# Altium schematic sheet 0_AD_ST32-Overview.SchDoc
size Letter; SheetNumber: 1; SheetTotal: 4
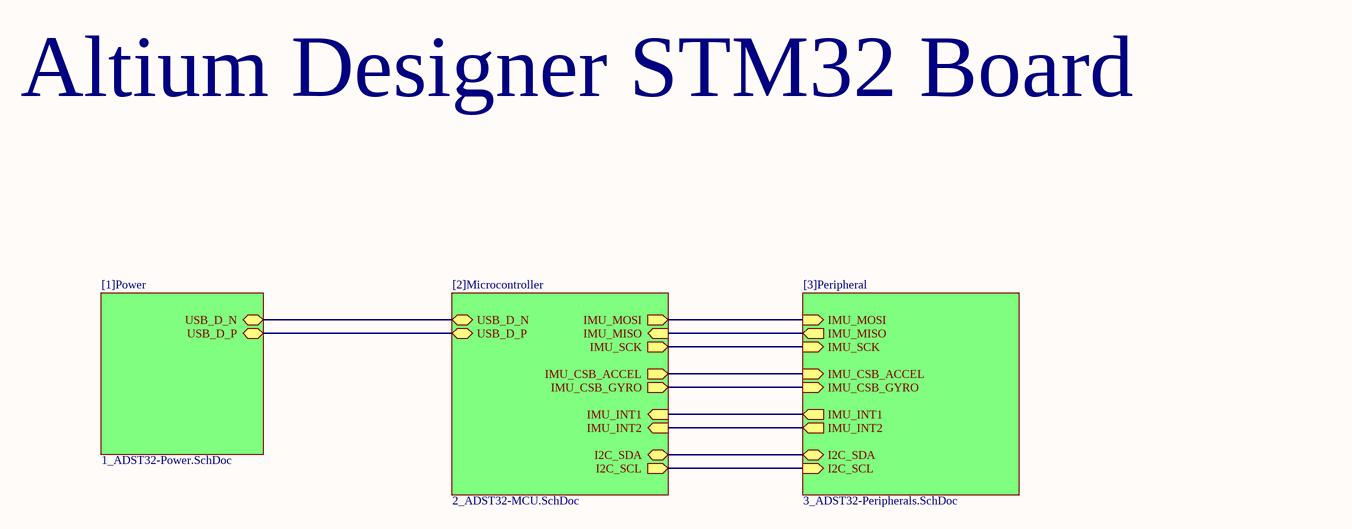
[diagram p0: 0_AD_ST32-Overview.SchDoc]

## Sub-sheets
[1]Power = 1_ADST32-Power.SchDoc: USB_D_N (bidir), USB_D_P (bidir)
[2]Microcontroller = 2_ADST32-MCU.SchDoc: USB_D_N (bidir), USB_D_P (bidir), IMU_SCK (out), IMU_MISO (in), IMU_MOSI (out), IMU_CSB_ACCEL (out), IMU_CSB_GYRO (out), I2C_SCL (out), I2C_SDA (bidir), IMU_INT1 (in), IMU_INT2 (in)
[3]Peripheral = 3_ADST32-Peripherals.SchDoc: IMU_MISO (out), IMU_CSB_ACCEL (in), IMU_CSB_GYRO (in), IMU_SCK (in), IMU_MOSI (in), IMU_INT1 (out), IMU_INT2 (out), I2C_SCL (in), I2C_SDA (bidir)

## Nets
(unnamed): sheet [1]Power/USB_D_N, sheet [2]Microcontroller/USB_D_N
(unnamed): sheet [1]Power/USB_D_P, sheet [2]Microcontroller/USB_D_P
(unnamed): sheet [2]Microcontroller/IMU_SCK, sheet [3]Peripheral/IMU_SCK
(unnamed): sheet [2]Microcontroller/IMU_MISO, sheet [3]Peripheral/IMU_MISO
(unnamed): sheet [2]Microcontroller/IMU_MOSI, sheet [3]Peripheral/IMU_MOSI
(unnamed): sheet [2]Microcontroller/IMU_CSB_ACCEL, sheet [3]Peripheral/IMU_CSB_ACCEL
(unnamed): sheet [2]Microcontroller/IMU_CSB_GYRO, sheet [3]Peripheral/IMU_CSB_GYRO
(unnamed): sheet [2]Microcontroller/I2C_SCL, sheet [3]Peripheral/I2C_SCL
(unnamed): sheet [2]Microcontroller/I2C_SDA, sheet [3]Peripheral/I2C_SDA
(unnamed): sheet [2]Microcontroller/IMU_INT1, sheet [3]Peripheral/IMU_INT1
(unnamed): sheet [2]Microcontroller/IMU_INT2, sheet [3]Peripheral/IMU_INT2

## Notes on the sheet
- Altium Designer STM32 Board